# Altium schematic sheet SD CARD.SchDoc
size A4
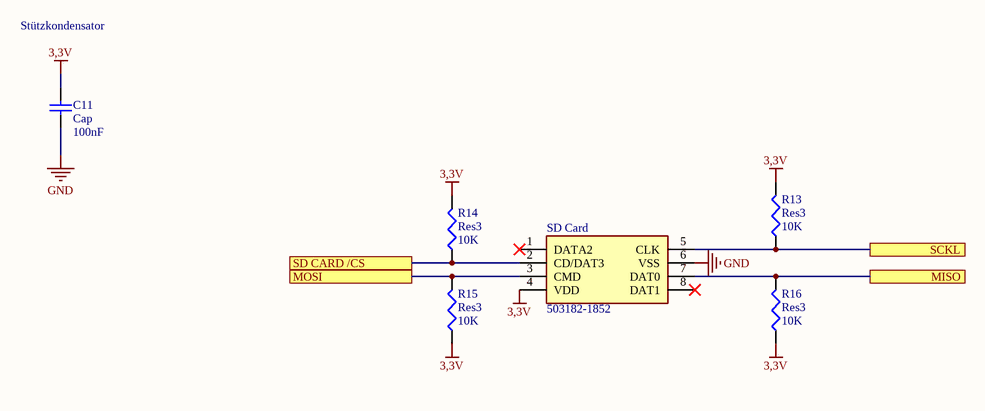
[diagram p0: SD CARD.SchDoc]

## Parts
C11  Cap  value 100nF  [1608[0603]]
R13  Res3  value 10K  [J1-0603]
R14  Res3  value 10K  [J1-0603]
R15  Res3  value 10K  [J1-0603]
R16  Res3  value 10K  [J1-0603]
SD_Card  503182-1852  [5031821852]

## Ports
MISO, MOSI, SCKL, SD CARD /CS

## Nets
3,3V: C11.2 R13.2 R14.2 R15.1 R16.1 SD_Card.4(VDD)
GND: C11.1 SD_Card.6(VSS)
MISO: R16.2 SD_Card.7(DAT0) ; port MISO
MOSI: R15.2 SD_Card.3(CMD) ; port MOSI
SCKL: R13.1 SD_Card.5(CLK) ; port SCKL
SD CARD /CS: R14.1 SD_Card.2(CD/DAT3) ; port SD CARD /CS

Not connected (* = marked no-connect by the designer): SD_Card 1(DATA2)* 8(DAT1)*

## Notes on the sheet
- Stützkondensator

## Library data of the parts
C11 = Cap: Capacitor; Published: 8-Jun-2000; LatestRevisionDate: 17-Jul-2002; LatestRevisionNote: Re-released for DXP Platform.; PackageReference: RAD-0.3; Publisher: Altium Limited; PackageDescription: Radial Cap, Thru-Hole; 2 Leads; 0.3 in Pin Spacing
R13-R16 = Res3: Resistor; Published: 8-Jun-2000; LatestRevisionDate: 29-May-2009; LatestRevisionNote: IPC-7351 Footprint Added.; PackageReference: J1-0603; Publisher: Altium Limited; PackageDescription: Chip Resistor
SD_Card = 503182-1852: Connector; Manufacturer_Name: Molex; Datasheet Link: https://componentsearchengine.com//503182-1852.pdf; Mouser2 Part Number: 538-503182-1852; Mouser2 Price/Stock: https://www.mouser.com/Search/Refine.aspx?Keyword=538-503182-1852; Manufacturer_Part_Number: 503182-1852